# EAGLE design MKS PWC (EAGLE 9.6.2)
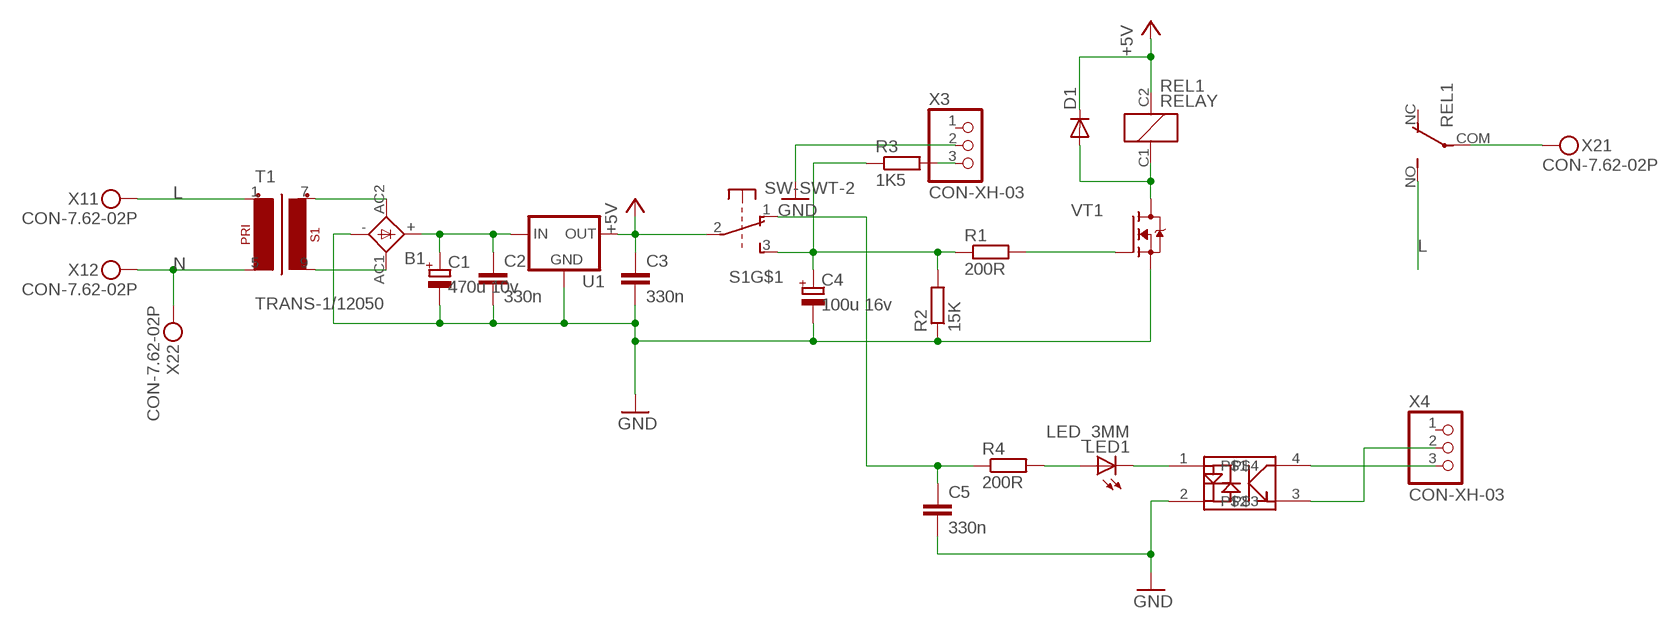
[diagram p0: schematic, sheet 1]

## Parts
B1  BRIDGEDBS  [DBS]
C1  470u 10v  CAP-POL_E2.5-7  [E2,5-7]
C2  330n  CAP_1206  [CAP1206]
C3  330n  CAP_1206  [CAP1206]
C4  100u 16v  CAP-POL_E2.5-7  [E2,5-7]
C5  330n  CAP_1206  [CAP1206]
D1  DIODE_ES1J  [DO214AC]
LED1  LED_3MM  [LED3MM]
R1  200R  R_R0805  [RESC2012X50]
R2  15K  R_R0805  [RESC2012X50]
R3  1K5  R_R0805  [RESC2012X50]
R4  200R  R_R0805  [RESC2012X50]
REL1  RELAY  [RELAY-15X18]
S1  SW-SWT-2  [SWT-2]
T1  TRANS-1/12050  [32.5-27.5-30]
U1  V-REGDPAK  [DPAK]
U$1  OPTO-EL3H4(TA)-VG  [SSOP4]
VT1  FET-NPF-2X2  [POWERFLAT-2X2]
X1  CON-7.62-02P  [KF25C-7.62-02P-13]
X2  CON-7.62-02P  [KF25C-7.62-02P-13]
X3  CON-XH-03  [XH-03]
X4  CON-XH-03  [XH-03]

## Nets
+5V: C3.1 D1.C REL1.C2 S1.2 U1.3(OUT)
GND: B1.- C1.- C2.2 C3.2 C4.- C5.2 R2.1 U1.2(PAD)(GND) U$1.2 VT1.S VT1.S4(S) X3.2
L: REL1.NO T1.1(P1-1) X1.P$1
N: T1.5(P1-2) X1.P$2 X2.P$2
N$1: B1.AC2 T1.7(S1-1)
N$2: B1.AC1 T1.9(S1-2)
N$3: C4.+ R1.1 R2.2 R3.1 S1.3
N$4: B1.+ C1.+ C2.1 U1.1(IN)
N$5: D1.A REL1.C1 VT1.D VT1.D1(D) VT1.D2(D) VT1.D5(D) VT1.D6(D)
N$6: R1.2 VT1.G3(G)
N$7: REL1.COM X2.P$1
N$8: R3.2 X3.3
N$9: C5.1 R4.1 S1.1
N$10: LED1.K(C) U$1.1
N$11: LED1.A R4.2
N$12: U$1.4 X4.3
N$13: U$1.3 X4.2
Unconnected: REL1.NC S1.4 S1.5 S1.6 X3.1 X4.1

## Library data of the parts
B1 = Flamberm:BRIDGE: GENERAL INSTRUMENT RECTIFIER
C1 C4 = Flamberm:CAP-POL_
C2 C3 C5 = Flamberm:CAP_
D1 = Flamberm:DIODE_
LED1 = Flamberm:LED_
R1-R4 = Flamberm:R_
REL1 = Flamberm:RELAY
S1 = Flamberm:SW-SWT-2
T1 = Flamberm:TRANS-1/1
U1 = Flamberm:V-REG
U$1 = Flamberm:OPTO-EL3H4(TA)-VG
VT1 = Flamberm:FET-N
X1 X2 = Flamberm:CON-7.62-02P
X3 X4 = Flamberm:CON-XH-03

## Board
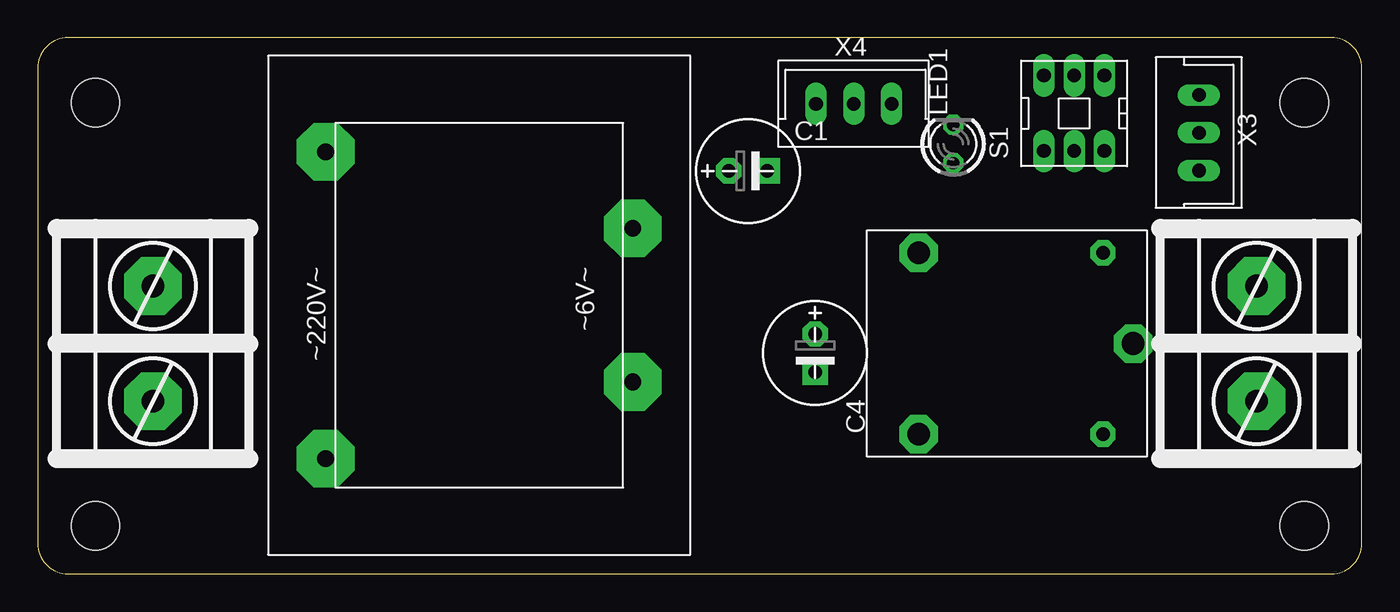
[diagram p1: board, top side]
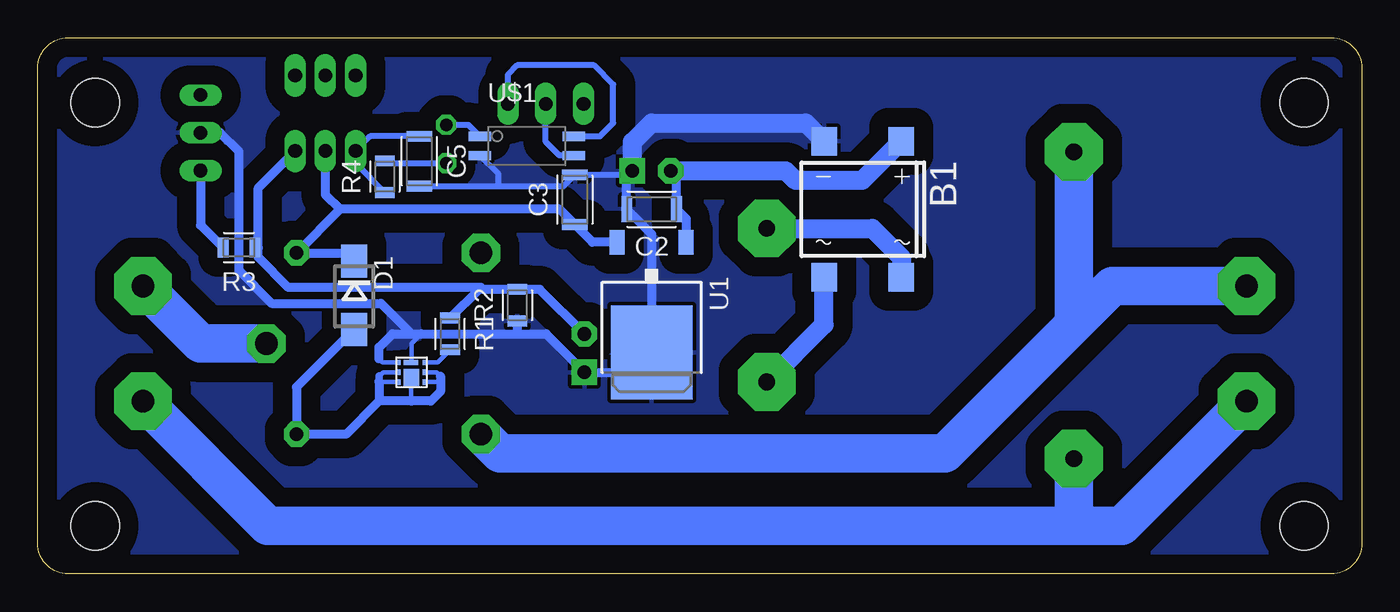
[diagram p2: board, bottom side, seen from below]

Size 87.61 x 35.48 mm. Coordinates in mm from the lower left corner, seen from the top.
Outline: 0,33.48 0,2 arc90 2,0 85.61,0 arc90 87.61,2 87.61,33.48 arc90 85.61,35.48 2,35.48 arc90 0,33.48
Copper layers (1*16): Top 0.035mm / dielectric 1.5mm / Bottom 0.035mm
Design rules "default": minimum track width 6mil, minimum drill 0.35mm, track to track 6mil, track to pad 6mil, pad to pad 6mil, via to via 6mil, smd to smd 6mil, copper to edge 40mil, drill to drill 6mil, minimum pad ring 10mil, minimum via ring 8mil, stop-mask expansion 4mil, vias tented up to drill 0mil, thermal gap 10mil
Holes 3.2 mm at 3.82,3.17 3.82,31.18 83.82,3.17 83.82,31.18

### Footprints (pad centres in the part's own frame; a part is rotated, then mirrored left to right if it is on the bottom)
DBS = smd 1.7 x 1.9: + -2.55,-4.5; - 2.55,-4.5; AC1 -2.55,4.5; AC2 2.55,4.5
E2,5-7 = drill 0.9 pad 1.676 octagon: + -1.27,0 | drill 0.9 pad 1.676 square: - 1.27,0
CAP1206 = smd 0.712 x 1.712: 1 -1.65,0; 2 1.65,0
DO214AC = smd 2.2 x 1.7: A 2.25,0; C -2.285,0
LED3MM = drill 0.813 octagon: A -1.27,0; K 1.27,0
RESC2012X50 = smd 0.712 x 1.312: 1 -1.05,0; 2 1.05,0
RELAY-15X18 = drill 0.9 pad 1.676 octagon: C1 -6.35,6; C2 -6.35,-6 | drill 1.5 pad 2.54 octagon: COM -8.35,0; NC 5.85,-6; NO 5.85,6
SWT-2 = drill 0.9 long: 1 -2.497,2; 2 -2.497,0; 3 -2.497,-2; 4 2.503,2; 5 2.503,0; 6 2.503,-2
32.5-27.5-30 = drill 1.1 pad 3.81 octagon: 1 -10.16,-10.16; 5 10.16,-10.16; 7 5.08,10.16; 9 -5.08,10.16
DPAK = smd 1 x 1.6: 1 -2.28,-4.8; 3 2.28,-4.8 | smd 5.4 x 6.2: 2(PAD) 0,2.5
SSOP4 = smd 0.6 x 1.5: 1 -0.635,-3.115; 2 0.635,-3.115; 3 0.635,3.115; 4 -0.635,3.115
POWERFLAT-2X2 = smd 1.125 x 1.05: D -0.34,0.028 | smd 0.35 x 0.3: D1 -0.65,-0.875; D2 0,-0.875; D5 0,0.875; D6 -0.65,0.875; G3 0.65,-0.875; S4 0.65,0.875 | smd 0.35 x 0.95: S 0.65,0.05
KF25C-7.62-02P-13 = drill 1.5 pad 3.81 octagon: P$1 -3.81,0; P$2 3.81,0
XH-03 = drill 0.9 long: 1 -2.48,0; 2 0.02,0; 3 2.52,0

### Placement (x,y rotation side)
B1  33.02,24.13 180 bottom
C1  46.99,26.67 0 top
C2  46.99,24.13 180 bottom
C3  52.07,24.77 90 bottom
C4  51.44,14.61 270 top
C5  62.36,27.3 270 bottom
D1  66.67,18.41 270 bottom
LED1  60.58,28.45 90 top
R1  60.33,15.88 270 bottom
R2  55.88,17.78 90 bottom
R3  74.3,21.59 180 bottom
R4  64.64,26.29 90 bottom
REL1  64.14,15.24 180 top
S1  68.58,30.48 90 top
T1  29.21,17.78 270 top
U1  46.99,17.14 180 bottom
U$1  55.24,28.32 270 bottom
VT1  62.87,13.34 90 bottom
X1  7.62,15.24 270 top
X2  80.64,15.24 270 top
X3  76.83,29.21 270 top
X4  53.98,31.11 0 top

### Tracks (layer width: path | path; a pad name or v marks a point on that pad's centre or on a via)
+5V
  Bottom 0.305: 67.22,21.24 D1.C
  Bottom 0.61: U1.3 50.9,21.95 C3.1 53.09,24.13 67.59,24.13 | 67.22,21.24 REL1.C2 67.59,24.13 | S1.2 68.58,25.11 67.59,24.13
GND
  Bottom 0.305: 48.3,13.34 U1.2(PAD) | VT1.S 62.87,14.04 62.87,15.24 62.23,15.88 | 65.02,14.22 64.78,13.98 VT1.S4
  Bottom 0.406: C5.2 57.15,25.66 | 57.15,25.66 52.83,25.66 C3.2 48.52,26.41 C1.- | U$1.2 57.15,26.48 57.15,25.66
  Bottom 0.61: C1.- 48.64,26.29 C2.2 46.99,22.48 U1.2(PAD) | 48.3,13.34 C4.- 53.98,15.88 55.88,15.88 | 65.02,14.22 65.02,14.99 64.14,15.88 62.87,15.88 | 55.88,15.88 62.23,15.88 62.87,15.88 | R2.1 55.88,15.88 | 62.87,15.88 64.9,17.91 72.14,17.91 74.3,20.07 74.3,27.94 75.56,29.21 76.81,29.21 X3.2
  Bottom 1.27: C1.- 48.26,28.57 46.99,29.84 36.78,29.84 B1.-
  pour Bottom (isolate 1.27): 0,28.57 0,33.56 arc-90 2,35.56 84.45,35.56 85.63,35.56 arc-90 87.63,33.56 87.63,3.81 87.63,2 arc-90 85.63,0 6.99,0 2,0 arc-90 0,2
L
  Bottom 2.54: REL1.NO 57.02,7.97 27.59,7.97 19.05,16.51 | 19.05,16.51 T1.1 | X1.P$1 16.51,19.05 19.05,16.51
N
  Bottom 2.54: X2.P$2 72.39,3.17 19.05,3.17 | 19.05,3.17 15.88,3.17 X1.P$2 | T1.5 19.05,3.17
N$1
  Bottom 1.27: T1.7 35.57,16.5 B1.AC2
N$2
  Bottom 1.27: T1.9 32.38,22.86 30.47,20.95 B1.AC1
N$3
  Bottom 0.61: C4.+ 54.39,18.83 R2.2 58.42,18.83 | R1.1 58.42,18.83 | 58.42,18.83 58.29,18.96 71.03,18.96 73.03,20.95 73.03,21.59 | 73.03,21.59 73.03,25.54 S1.3 | R3.1 73.03,21.59
N$4
  Bottom 0.61: C1.+ 45.34,26.29 C2.1 44.71,23.5 U1.1
  Bottom 1.27: B1.+ 33.06,26.04 37.47,26.04 38.1,26.67 C1.+
N$5
  Bottom 0.305: VT1.D2 61.21,13.34 60.96,13.08 | VT1.D1 60.98,12.69 60.96,12.7 | VT1.D 62.89,11.43 | VT1.D5 64.77,13.34 65.02,13.08 | VT1.D6 65.01,12.69 65.02,12.7
  Bottom 0.508: 65.02,13.08 65.02,12.7
  Bottom 0.61: 60.96,13.08 60.96,12.7 60.96,12.06 61.59,11.43 62.89,11.43 65.02,11.43 | 65.02,12.7 65.02,11.43 | 65.02,11.43 67.21,9.24 REL1.C1 70.48,12.36 D1.A
N$6
  Bottom 0.305: 61.98,13.97 VT1.G3 61.16,13.98 R1.2
N$7
  Bottom 2.54: X2.P$1 76.83,15.24 REL1.COM
N$8
  Bottom 0.61: X3.3 76.83,23.08 R3.2
N$9
  Bottom 0.305: 62.39,28.99 C5.1
  Bottom 0.406: C5.1 65.61,28.95 S1.1 66.58,27.18 R4.1
N$10
  Bottom 0.406: LED1.K 59.12,29.72 U$1.1
N$11
  Bottom 0.406: R4.2 64.48,27.18 LED1.A
N$12
  Bottom 0.406: U$1.4 50.42,28.96 49.53,29.84 49.53,32.38 50.8,33.66 55.88,33.66 56.52,33.02 56.52,31.14 X4.3
N$13
  Bottom 0.406: U$1.3 53.09,27.69 53.99,28.59 X4.2